# Altium schematic sheet Digital Interfaces.SchDoc
size A4; CompanyName: Technische Hochschule Nürnberg Georg Simon Ohm; Organization: UltraZohm; Address1: Kesslerplatz 12; Address2: 90489 Nürnberg; Address3: GERMANY; DocumentNumber: 7; SheetNumber: 7; SheetTotal: 12; Website: www.ultrazohm.com
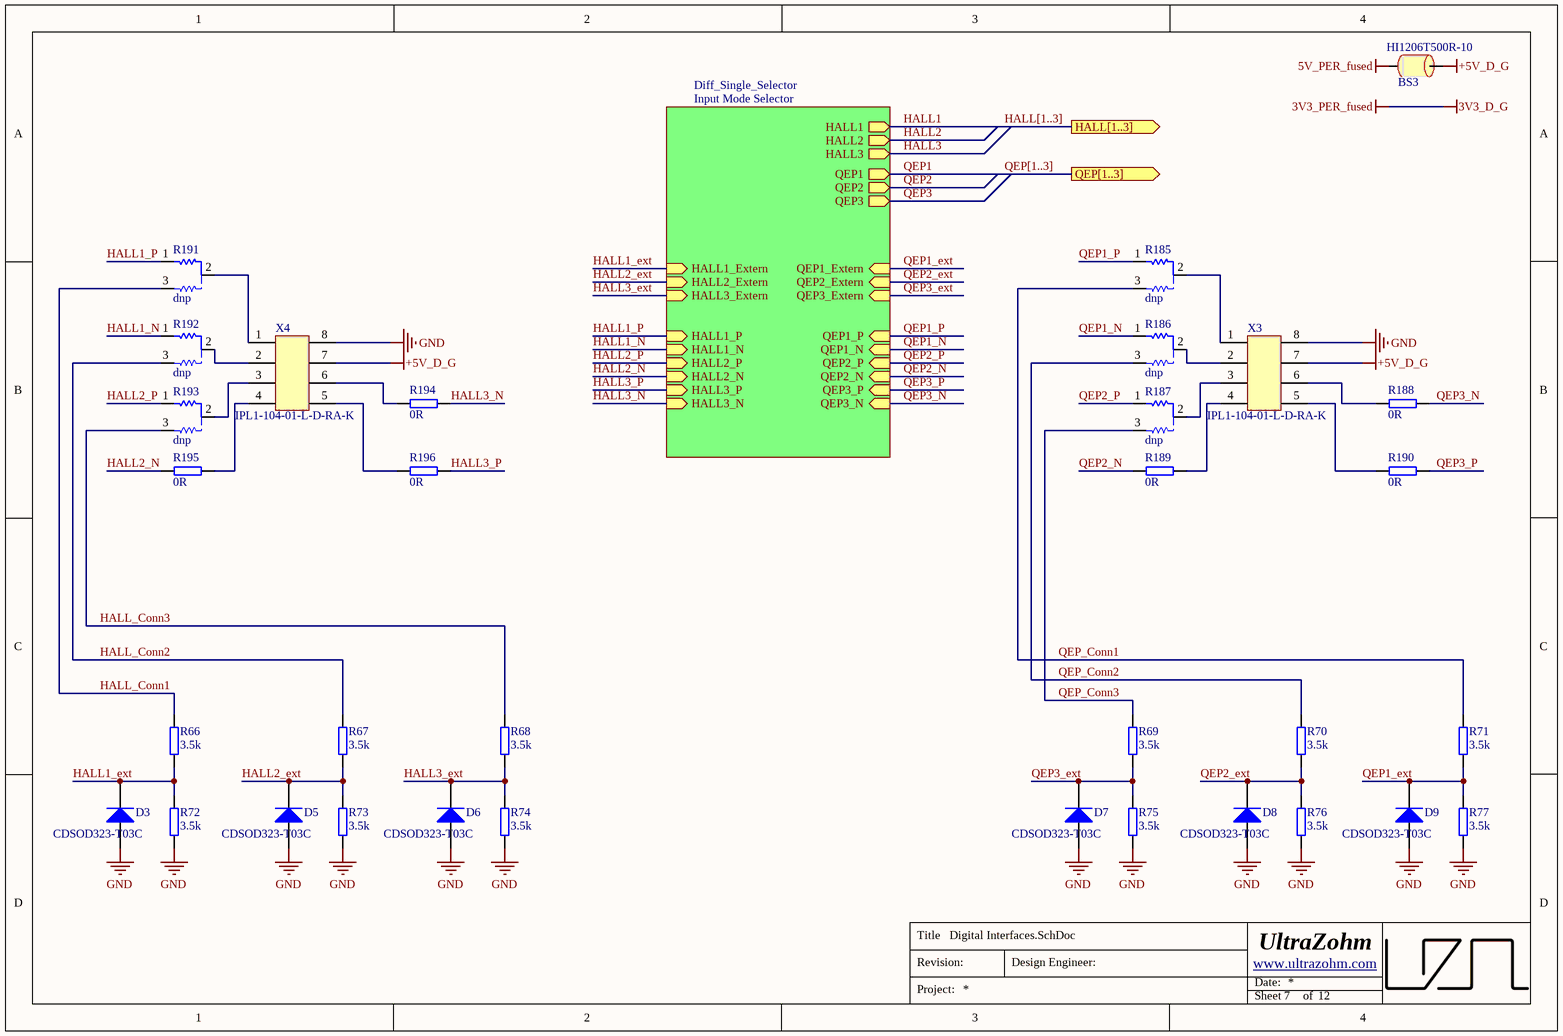
[diagram p0: Digital Interfaces.SchDoc]

## Parts
BS3  HI1206T500R-10  [RES_1206]
D3  CDSOD323-T03C  [SOD-323]
D5  CDSOD323-T03C  [SOD-323]
D6  CDSOD323-T03C  [SOD-323]
D7  CDSOD323-T03C  [SOD-323]
D8  CDSOD323-T03C  [SOD-323]
D9  CDSOD323-T03C  [SOD-323]
R66  3.5k  [RESC1608X06N]
R67  3.5k  [RESC1608X06N]
R68  3.5k  [RESC1608X06N]
R69  3.5k  [RESC1608X06N]
R70  3.5k  [RESC1608X06N]
R71  3.5k  [RESC1608X06N]
R72  3.5k  [RESC1608X06N]
R73  3.5k  [RESC1608X06N]
R74  3.5k  [RESC1608X06N]
R75  3.5k  [RESC1608X06N]
R76  3.5k  [RESC1608X06N]
R77  3.5k  [RESC1608X06N]
R185  dnp  [0603_Config]
R186  dnp  [0603_Config]
R187  dnp  [0603_Config]
R188  0R  [RESC1608X06N]
R189  0R  [RESC1608X06N]
R190  0R  [RESC1608X06N]
R191  dnp  [0603_Config]
R192  dnp  [0603_Config]
R193  dnp  [0603_Config]
R194  0R  [RESC1608X06N]
R195  0R  [RESC1608X06N]
R196  0R  [RESC1608X06N]
X3  IPL1-104-01-L-D-RA-K  [Conector 4x2 TH Horizontal]
X4  IPL1-104-01-L-D-RA-K  [Conector 4x2 TH Horizontal]

## Sub-sheets
Diff_Single_Selector = Input Mode Selector: QEP3_Extern (in), HALL2 (out), QEP2 (out), QEP1 (out), HALL3 (out), HALL3_Extern (in), QEP2_Extern (in), HALL2_Extern (in), HALL1_Extern (in), QEP1_Extern (in), HALL1 (out), QEP3 (out), HALL2_N (in), HALL1_N (in), HALL1_P (in), HALL2_P (in), HALL3_P (in), HALL3_N (in), QEP2_N (in), QEP3_P (in), QEP2_P (in), QEP3_N (in), QEP1_N (in), QEP1_P (in)

## Ports
HALL[1..3] (out), QEP[1..3] (out)

## Nets
5V_PER_fused: BS3.2
+5V_D_G: BS3.1 X3.7 X4.7
GND: D3.2(A) D5.2(A) D6.2(A) D7.2(A) D8.2(A) D9.2(A) R72.2 R73.2 R74.2 R75.2 R76.2 R77.2 X3.8 X4.8
HALL1: sheet Diff_Single_Selector/HALL1
HALL1_ext: D3.1(K) R66.2 R72.1 ; sheet Diff_Single_Selector/HALL1_Extern
HALL1_N: R192.1 ; sheet Diff_Single_Selector/HALL1_N
HALL1_P: R191.1 ; sheet Diff_Single_Selector/HALL1_P
HALL2: sheet Diff_Single_Selector/HALL2
HALL2_ext: D5.1(K) R67.2 R73.1 ; sheet Diff_Single_Selector/HALL2_Extern
HALL2_N: R195.1 ; sheet Diff_Single_Selector/HALL2_N
HALL2_P: R193.1 ; sheet Diff_Single_Selector/HALL2_P
HALL3: sheet Diff_Single_Selector/HALL3
HALL3_ext: D6.1(K) R68.2 R74.1 ; sheet Diff_Single_Selector/HALL3_Extern
HALL3_N: R194.2 ; sheet Diff_Single_Selector/HALL3_N
HALL3_P: R196.2 ; sheet Diff_Single_Selector/HALL3_P
HALL_Conn1: R66.1 R191.3
HALL_Conn2: R67.1 R192.3
HALL_Conn3: R68.1 R193.3
QEP1: sheet Diff_Single_Selector/QEP1
QEP1_ext: D9.1(K) R71.2 R77.1 ; sheet Diff_Single_Selector/QEP1_Extern
QEP1_N: R186.1 ; sheet Diff_Single_Selector/QEP1_N
QEP1_P: R185.1 ; sheet Diff_Single_Selector/QEP1_P
QEP2: sheet Diff_Single_Selector/QEP2
QEP2_ext: D8.1(K) R70.2 R76.1 ; sheet Diff_Single_Selector/QEP2_Extern
QEP2_N: R189.1 ; sheet Diff_Single_Selector/QEP2_N
QEP2_P: R187.1 ; sheet Diff_Single_Selector/QEP2_P
QEP3: sheet Diff_Single_Selector/QEP3
QEP3_ext: D7.1(K) R69.2 R75.1 ; sheet Diff_Single_Selector/QEP3_Extern
QEP3_N: R188.2 ; sheet Diff_Single_Selector/QEP3_N
QEP3_P: R190.2 ; sheet Diff_Single_Selector/QEP3_P
QEP_Conn1: R71.1 R185.3
QEP_Conn2: R70.1 R186.3
QEP_Conn3: R69.1 R187.3
NetR185_2: R185.2 X3.1
NetR186_2: R186.2 X3.2
NetR187_2: R187.2 X3.3
NetR188_1: R188.1 X3.6
NetR189_2: R189.2 X3.4
NetR190_1: R190.1 X3.5
NetR191_2: R191.2 X4.1
NetR192_2: R192.2 X4.2
NetR193_2: R193.2 X4.3
NetR194_1: R194.1 X4.6
NetR195_2: R195.2 X4.4
NetR196_1: R196.1 X4.5

## Buses and harness runs
bus HALL[1..3] = port HALL[1..3]
bus QEP[1..3] = port QEP[1..3]

## Notes on the sheet
- Title
- Revision:
- Design Engineer:
- Date:
- Project:
- Sheet
- of

## Library data of the parts
BS3 = Bead: Ferrite bead 6A; MF: Laird; Supplier Part Number 2: 240-2412-1-ND; MFN: HI1206T500R-10; Supplier 2: Digi-Key; Supplier 1: Mouser; Supplier Part Number 1: 875-HI1206T500R-10; Package: 1206
D3 D5-D9 = Diodo TVS: TVS DIODE 3.3V 19V SOD323; MF: Bourns; Supplier Part Number 2: CDSOD323-T03CCT-ND; MPN: CDSOD323-T03C; Supplier Part Number 1: 652-CDSOD323-T03C; Package: SOD-323-2; Supplier 2: Digi-Key; Supplier 1: Mouser
R66-R77 = R_0603: Value: 3.5k; MF: *; MPN: *; Supplier 1: *; Supplier Part Number 1: *
R185-R187 R191-R193 = R_config: Solder 0603 resistor/jumper between pads 1 and 2 for standard function. Solter resistor between pads 2 and 3 for alternative function; MPN: MCWR06X1002FTL; Value: 0R; MF: Multicomp; Voltage: 50V; Power: 100mW; Tolerance: 1%; Created: 2018_09_04_AGeiger; Package: 0603; Supplier Part Number 1: 2447230; Supplier 1: Farnell
R188-R190 R194-R196 = R_0603: MPN: CRCW06030000Z0EAC; MF: Vishay; Value: 0R; Supplier 1: Mouser; Supplier Part Number 1: 71-CRCW06030000Z0EAC
X3 X4 = Conector 4x2 Horizontal: CONN HEADER R/A 8POS 2.54MM Through Hole; MF: Samtec; Supplier Part Number 2: SAM9596-ND; MPN: IPL1-104-01-L-D-RA-K; Supplier Part Number 1: 200-IPL110401LDRAK; Supplier 1: Mouser; Supplier 2: Digi-Key